# EAGLE design BMW_variante (EAGLE 6.4)

## Sheet 1 of 2
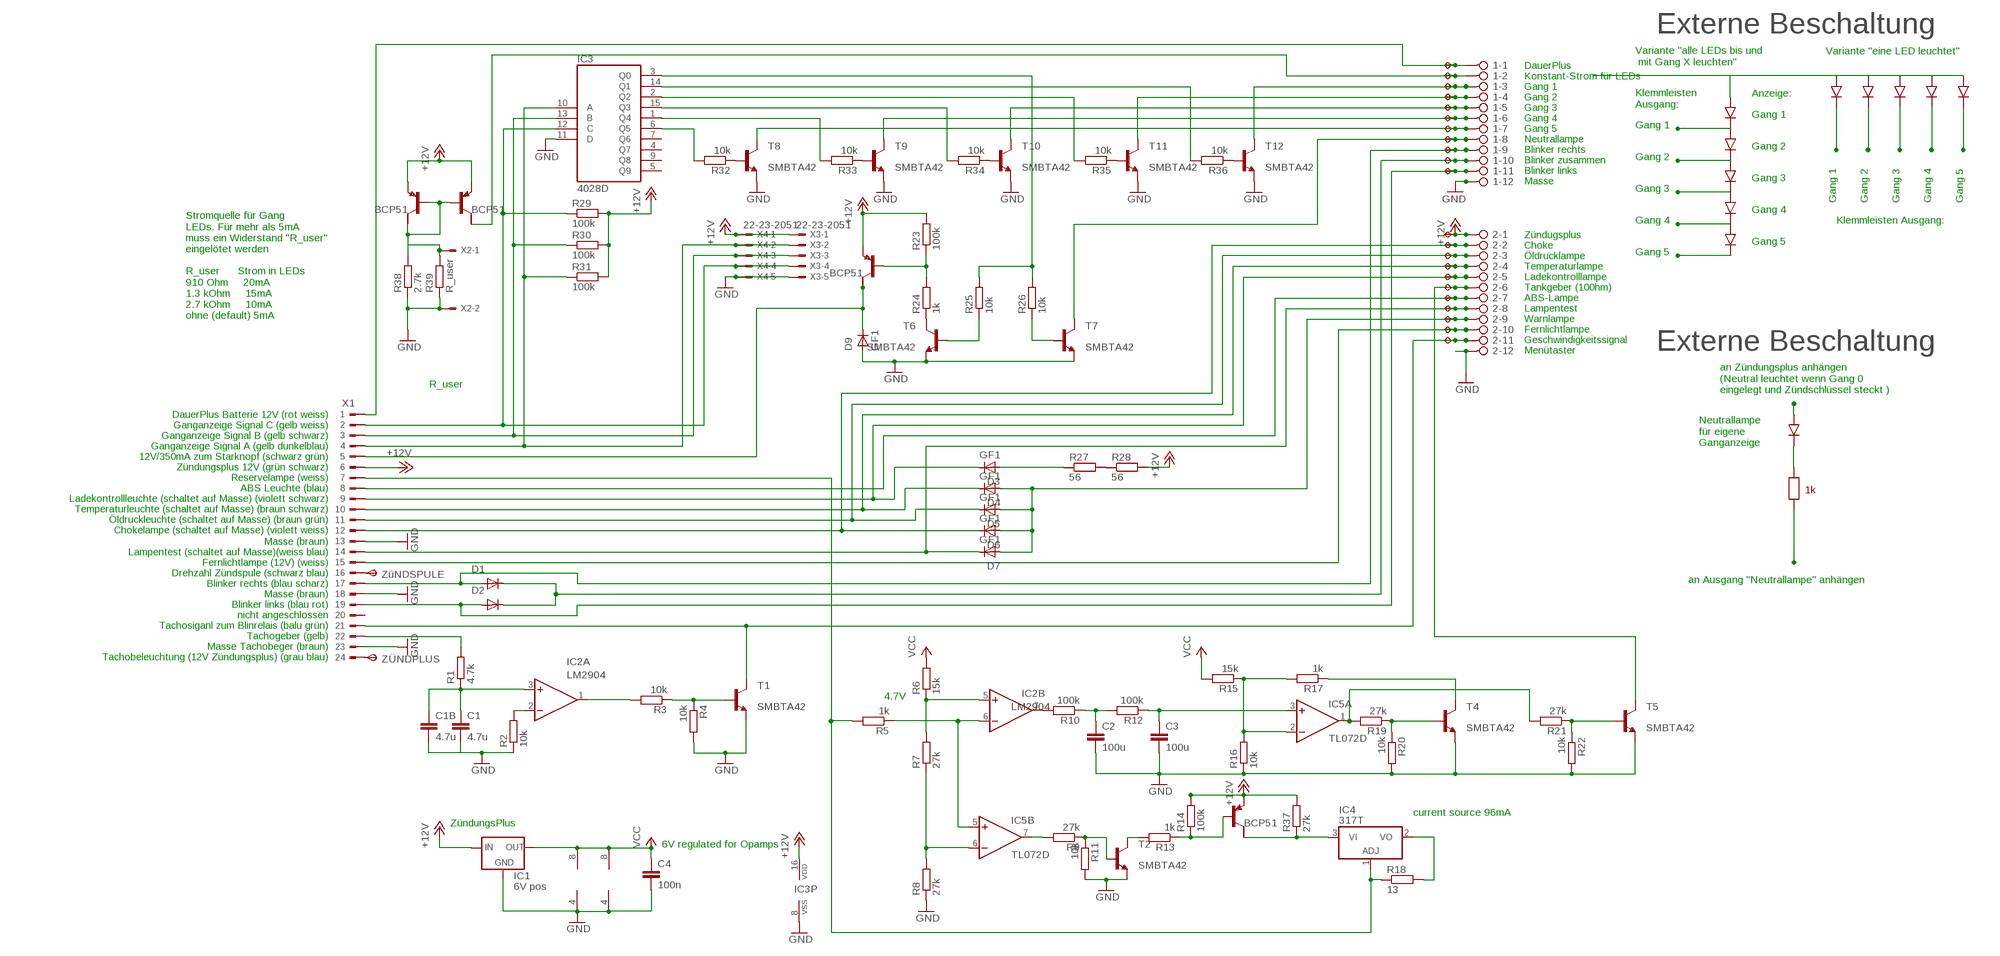
[diagram p0: schematic, sheet 1]

### Parts
1  2081-1132  [12-PIN]
2  2081-1132  [12-PIN]
C1  4.7u  C-EUC1206  [C1206]
C1B  4.7u  C-EUC0805K  [C0805K]
C2  100u  C-EUC1206K  [C1206K]
C3  100u  C-EUC1206K  [C1206K]
C4  100n  C-EUC1206K  [C1206K]
D1  GF1  [SMA-DO214AC]
D2  GF1  [SMA-DO214AC]
D3  GF1  [SMA-DO214AC]
D4  GF1  [SMA-DO214AC]
D5  GF1  [SMA-DO214AC]
D6  GF1  [SMA-DO214AC]
D7  GF1  [SMA-DO214AC]
D9  GF1  [SMA-DO214AC]
IC1  6V pos  78LXX  [78LXX]
IC2  LM358D  [SO08]
IC3  4028D  [SO16]
IC4  317T  [TO220H]
IC5  TL072D  [SO08]
R1  4.7k  R-EU_R0805  [R0805]
R2  10k  R-EU_R0805  [R0805]
R3  10k  R-EU_R0805  [R0805]
R4  10k  R-EU_R0805  [R0805]
R5  1k  R-EU_R0805  [R0805]
R6  15k  R-EU_R0805  [R0805]
R7  27k  R-EU_R0805  [R0805]
R8  27k  R-EU_R0805  [R0805]
R9  27k  R-EU_R0805  [R0805]
R10  100k  R-EU_R0805  [R0805]
R11  10k  R-EU_R0805  [R0805]
R12  100k  R-EU_R0805  [R0805]
R13  1k  R-EU_R0805  [R0805]
R14  100k  R-EU_R0805  [R0805]
R15  15k  R-EU_R0805  [R0805]
R16  10k  R-EU_R0805  [R0805]
R17  1k  R-EU_R0805  [R0805]
R18  13  R-EU_0207/10  [0207/10]
R19  27k  R-EU_R0805  [R0805]
R20  10k  R-EU_R0805  [R0805]
R21  27k  R-EU_R0805  [R0805]
R22  10k  R-EU_R0805  [R0805]
R23  100k  R-EU_R0805  [R0805]
R24  1k  R-EU_R0805  [R0805]
R25  10k  R-EU_R0805  [R0805]
R26  10k  R-EU_R0805  [R0805]
R27  56  R-EU_V235/17  [V235/17]
R28  56  R-EU_V235/17  [V235/17]
R29  100k  R-EU_R0805  [R0805]
R30  100k  R-EU_R0805  [R0805]
R31  100k  R-EU_R0805  [R0805]
R32  10k  R-EU_R0805  [R0805]
R33  10k  R-EU_R0805  [R0805]
R34  10k  R-EU_R0805  [R0805]
R35  10k  R-EU_R0805  [R0805]
R36  10k  R-EU_R0805  [R0805]
R37  27k  R-EU_R0805  [R0805]
R38  2.7k  R-EU_R0805  [R0805]
R39  R_user  R-EU_R0805  [R0805]
T  BCP53T1  [SOT223]
T1  MMBTA42LT1-NPN-SOT23-BEC  [SOT23-BEC]
T2  MMBTA42LT1-NPN-SOT23-BEC  [SOT23-BEC]
T3  BCP53T1  [SOT223]
T4  MMBTA42LT1-NPN-SOT23-BEC  [SOT23-BEC]
T5  MMBTA42LT1-NPN-SOT23-BEC  [SOT23-BEC]
T6  MMBTA42LT1-NPN-SOT23-BEC  [SOT23-BEC]
T7  MMBTA42LT1-NPN-SOT23-BEC  [SOT23-BEC]
T8  MMBTA42LT1-NPN-SOT23-BEC  [SOT23-BEC]
T9  MMBTA42LT1-NPN-SOT23-BEC  [SOT23-BEC]
T10  MMBTA42LT1-NPN-SOT23-BEC  [SOT23-BEC]
T11  MMBTA42LT1-NPN-SOT23-BEC  [SOT23-BEC]
T12  MMBTA42LT1-NPN-SOT23-BEC  [SOT23-BEC]
T13  BCP53T1  [SOT223]
T14  BCP53T1  [SOT223]
TP1  TPB1,27  [B1,27]
TP2  TPB1,27  [B1,27]
TP3  TPB1,27  [B1,27]
TP4  TPB1,27  [B1,27]
TP5  TPB1,27  [B1,27]
TP6  TPB1,27  [B1,27]
TP7  TPB1,27  [B1,27]
TP8  TPB1,27  [B1,27]
TP9  TPB1,27  [B1,27]
TP10  TPB1,27  [B1,27]
TP11  TPB1,27  [B1,27]
TP12  TPB1,27  [B1,27]
TP16  TPB1,27  [B1,27]
TP17  TPB1,27  [B1,27]
TP18  TPB1,27  [B1,27]
TP19  TPB1,27  [B1,27]
TP21  TPB1,27  [B1,27]
TP22  TPB1,27  [B1,27]
TP23  TPB1,27  [B1,27]
TP24  TPB1,27  [B1,27]
TP25  TPB1,27  [B1,27]
TP26  TPB1,27  [B1,27]
X1  CON_BMW  [24-PIN]
X2  22-23-2021  [22-23-2021]
X3  22-23-2051  [22-23-2051]
X4  22-23-2051  [22-23-2051]
ZÜNDPLUS  TPSP1_1MM  [P1_1.0MM]
ZüNDSPULE  TPSP1_1MM  [P1_1.0MM]

### Nets
+12V: 2.1 IC1.IN IC3.16(VDD) R14.2 R23.2 R28.2 R29.2 R30.2 R31.2 R37.2 T3.3(E) T13.3(E) T14.3(E) T.3(E) TP12.TP X1.6 X3.1 X4.1
GND: 1.12 2.12 C1.2 C1B.2 C2.2 C3.2 C4.2 D9.A IC1.GND IC2.4(P:V-) IC3.8(VSS) IC3.11(D) IC5.4(P:V-) R2.1 R4.2 R8.1 R11.2 R16.1 R20.2 R22.2 R38.1 R39.1 T1.E T2.E T4.E T5.E T6.E T7.E T8.E T9.E T10.E T11.E T12.E X1.13 X1.18 X1.23 X2.2 X3.5 X4.5 ; also sheet 2
N$1: 2.9 D4.A D5.A D6.A D7.A TP24.TP
N$2: IC3.10(A) R31.1 X1.4 X3.2 X4.2
N$3: IC3.13(B) R30.1 X1.3 X3.3 X4.3
N$4: 2.7 TP22.TP X1.8
N$5: R25.1 T6.B
N$6: IC3.3(Q0) R25.2 R26.2
N$7: R24.1 T6.C
N$8: R27.2 R28.1
N$9: R23.1 R24.2 T.1(B)
N$10: R26.1 T7.B
N$11: D9.K(C) T.2(C) X1.5
N$12: 2.2 D6.K(C) TP16.TP X1.12
N$13: 2.3 D5.K(C) TP17.TP X1.11
N$14: 2.4 D4.K(C) TP18.TP X1.10
N$15: IC4.1(ADJ) R5.2 R18.1 X1.7
N$16: IC2.6(B:-IN) IC5.5(B:+IN) R5.1
N$17: IC3.12(C) R29.1 X1.2 X3.4 X4.4
N$18: R32.1 T8.B
N$19: 2.8 D7.K(C) TP23.TP X1.14
N$20: 1.9 D1.A TP9.TP X1.17
N$21: 1.11 D2.A TP11.TP X1.19
N$22: 1.10 D1.K(C) D2.K(C) TP10.TP
N$23: R1.2 X1.22
N$24: C1.1 C1B.1 IC2.3(A:+IN) R1.1
N$25: IC2.2(A:-IN) R2.2
N$26: 2.11 T1.C TP26.TP X1.21
N$27: IC2.1(A:OUT) R3.2
N$28: R3.1 R4.1 T1.B
N$29: IC4.2(VO) R18.2
N$30: IC5.6(B:-IN) R7.1 R8.2
N$31: IC5.7(B:OUT) R9.2
N$32: R13.2 T2.C
N$34: R9.1 R11.1 T2.B
N$35: IC4.3(VI) R37.1 T3.2(C)
N$36: R13.1 R14.1 T3.1(B)
N$37: IC3.14(Q1) R36.2
N$38: IC3.2(Q2) R35.2
N$39: 1.5 T10.C TP5.TP
N$40: IC2.5(B:+IN) R6.1 R7.2
N$41: IC2.7(B:OUT) R10.2
N$42: X1.16 ZüNDSPULE.TP(PP)
N$43: IC5.1(A:OUT) R19.2 R21.2
N$44: R19.1 R20.1 T4.B
N$45: C2.1 R10.1 R12.2
N$46: C3.1 IC5.3(A:+IN) R12.1
N$47: IC5.2(A:-IN) R15.1 R16.2 R17.2
N$48: R21.1 R22.1 T5.B
N$49: R17.1 T4.C
N$50: 1.6 T9.C TP6.TP
N$51: R34.1 T10.B
N$52: 1.8 T7.C TP8.TP
N$53: 2.10 TP25.TP X1.15
N$54: D3.A R27.1
N$55: 2.5 D3.K(C) TP19.TP X1.9
N$56: R33.1 T9.B
N$57: R35.1 T11.B
N$58: X1.24 ZÜNDPLUS.TP(PP)
N$59: 1.2 T14.2(C) TP2.TP
N$60: 2.6 T5.C TP21.TP
N$61: IC3.6(Q5) R32.2
N$62: R36.1 T12.B
N$63: 1.7 T8.C TP7.TP
N$64: IC3.1(Q4) R33.2
N$65: IC3.15(Q3) R34.2
N$66: 1.4 T11.C TP4.TP
N$67: 1.3 T12.C TP3.TP
N$68: R38.2 R39.2 T13.1(B) T13.2(C) T14.1(B) X2.1
N$69: 1.1 TP1.TP X1.1
VCC: C4.1 IC1.OUT IC2.8(P:V+) IC5.8(P:V+) R6.2 R15.2 ; also sheet 2
Unconnected: IC3.4(Q7) IC3.5(Q9) IC3.7(Q6) IC3.9(Q8) T3.4(C/) T13.4(C/) T14.4(C/) T.4(C/) X1.20

### Notes on the sheet
- Externe Beschaltung
- Variante "eine LED leuchtet"
- Variante "alle LEDs bis und
   mit Gang X leuchten"
- Anzeige:
- Klemmleisten
  Ausgang:
- Gang 1
- DauerPlus
  Konstant-Strom für LEDs
  Gang 1
  Gang 2
  Gang 3
  Gang 4
  Gang 5
  Neutrallampe
  Blinker rechts
  Blinker zusammen
  Blinker links
  Masse
- Gang 1
- Gang 2
- Gang 2
- Gang 3
- Gang 3
- Gang 1 | Gang 2 | Gang 3 | Gang 4 | Gang 5
- Gang 4
- Gang 4 | Klemmleisten Ausgang:
- Gang 5
- Gang 5
- Zündugsplus
  Choke
  Öldrucklampe
  Temperaturlampe
  Ladekontrolllampe
  Tankgeber (100hm)
  ABS-Lampe
  Lampentest
  Warnlampe
  Fernlichtlampe
  Geschwindigkeitssignal
  Menütaster
- Stromquelle für Gang 
  LEDs. Für mehr als 5mA
  muss ein Widerstand "R_user"
  eingelötet werden 
  
  R_user      Strom in LEDs
  910 Ohm     20mA
  1.3 kOhm     15mA
  2.7 kOhm     10mA
  ohne (default) 5mA
- Externe Beschaltung
- R_user
- an Zündungsplus anhängen
  (Neutral leuchtet wenn Gang 0
  eingelegt und Zündschlüssel steckt )
- Neutrallampe
  für eigene
  Ganganzeige
- DauerPlus Batterie 12V (rot weiss)
  Ganganzeige Signal C (gelb weiss)
  Ganganzeige Signal B (gelb schwarz)
  Ganganzeige Signal A (gelb dunkelblau)
  12V/350mA zum Starknopf (schwarz grün)
  Zündungsplus 12V (grün schwarz)
  Reservelampe (weiss)
  ABS Leuchte (blau)
  Ladekontrollleuchte (schaltet auf Masse) (violett schwarz)
  Temperaturleuchte (schaltet auf Masse) (braun schwarz)
  Öldruckleuchte (schaltet auf Masse) (braun grün)
  Chokelampe (schaltet auf Masse) (violett weiss)
- 1k
- an Ausgang "Neutrallampe" anhängen
- Masse (braun)
  Lampentest (schaltet auf Masse)(weiss blau)
  Fernlichtlampe (12V) (weiss)
  Drehzahl Zündspule (schwarz blau)
  Blinker rechts (blau scharz)
  Masse (braun)
  Blinker links (blau rot)
  nicht angeschlossen
  Tachosiganl zum Blinrelais (balu grün)
  Tachogeber (gelb)
  Masse Tachobeger (braun)
  Tachobeleuchtung (12V Zündungsplus) (grau blau)
- 4.7V
- current source 96mA
- ZündungsPlus
- 6V regulated for Opamps

## Sheet 2 of 2
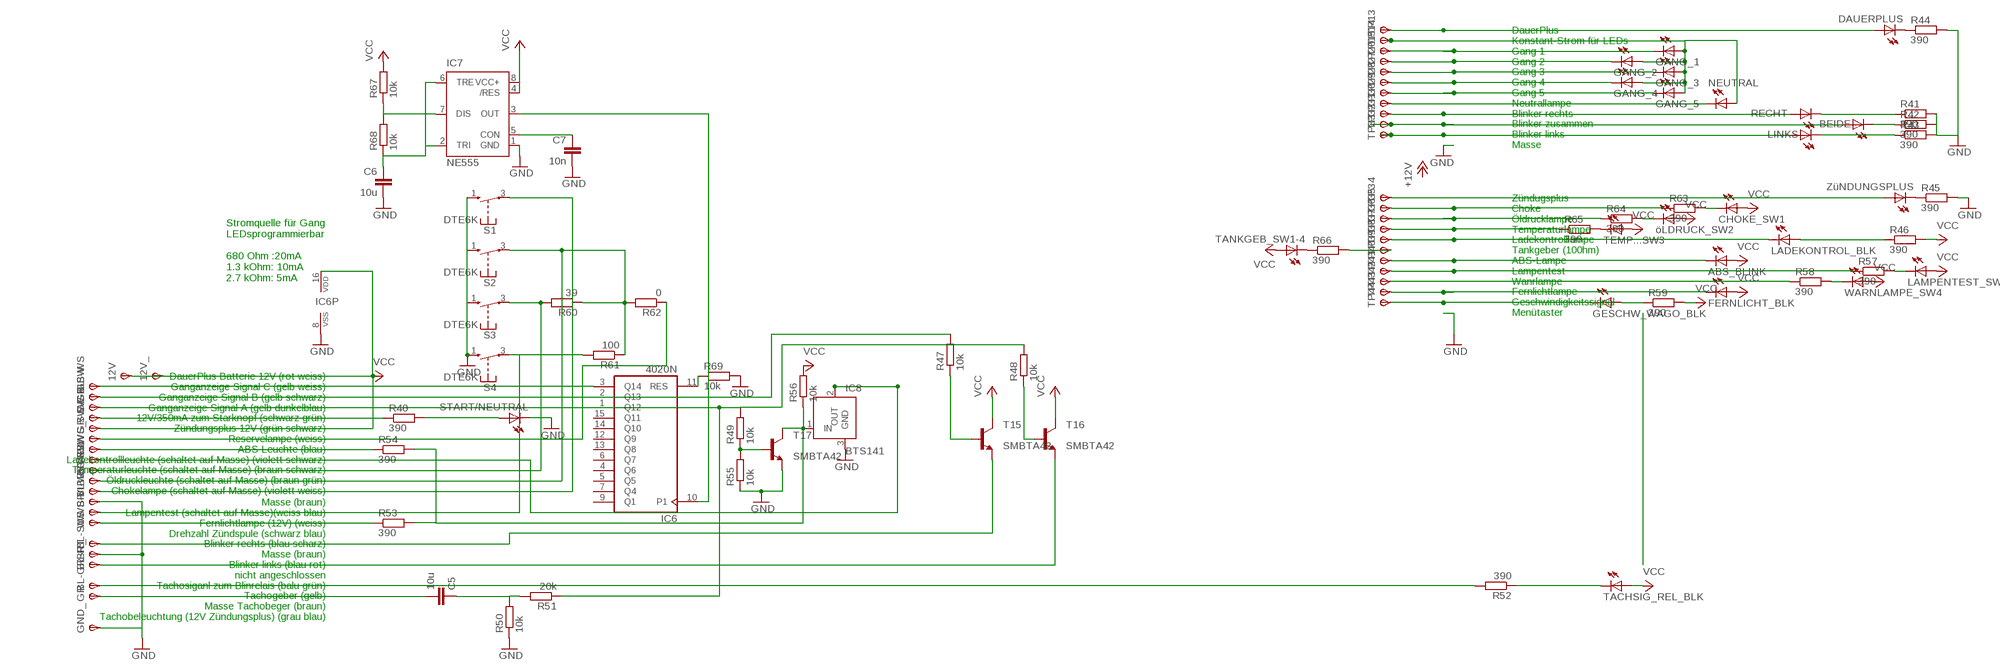
[diagram p1: schematic, sheet 2]

### Parts
12V  TPSPAD1-1.5MM  [P1-13]
12V_  TPSPAD1-1.5MM  [P1-13]
ABS_BLINK  TLLY4400  [LED3MM]
BEIDE  TLLY4400  [LED3MM]
BL  TPSPAD1-1.5MM  [P1-13]
BL-GR  TPSPAD1-1.5MM  [P1-13]
BL-RT  TPSPAD1-1.5MM  [P1-13]
BL-SW  TPSPAD1-1.5MM  [P1-13]
BR  TPSPAD1-1.5MM  [P1-13]
BR-GR  TPSPAD1-1.5MM  [P1-13]
BR-SW  TPSPAD1-1.5MM  [P1-13]
BR_  TPSPAD1-1.5MM  [P1-13]
C5  10u  C-EU025-024X044  [C025-024X044]
C6  10u  C-EU025-024X044  [C025-024X044]
C7  10n  C-EU025-024X044  [C025-024X044]
CHOKE_SW1  TLLY4400  [LED3MM]
DAUERPLUS  TLLY4400  [LED3MM]
FERNLICHT_BLK  TLLY4400  [LED3MM]
GANG_1  TLLY4400  [LED3MM]
GANG_2  TLLY4400  [LED3MM]
GANG_3  TLLY4400  [LED3MM]
GANG_4  TLLY4400  [LED3MM]
GANG_5  TLLY4400  [LED3MM]
GB-SW  TPSPAD1-1.5MM  [P1-13]
GB-WS  TPSPAD1-1.5MM  [P1-13]
GE-BL  TPSPAD1-1.5MM  [P1-13]
GESCHW_WAGO_BLK  TLLY4400  [LED3MM]
GND_  TPSPAD1-1.5MM  [P1-13]
GR  TPSPAD1-1.5MM  [P1-13]
GR-SW  TPSPAD1-1.5MM  [P1-13]
IC6  4020N  [DIL16]
IC7  NE555  [DIL-08]
IC8  BTS141  [TO220-3-45]
LADEKONTROL_BLK  TLLY4400  [LED3MM]
LAMPENTEST_SW4  TLLY4400  [LED3MM]
LINKS  TLLY4400  [LED3MM]
NEUTRAL  TLLY4400  [LED3MM]
R40  390  R-EU_R0805  [R0805]
R41  390  R-EU_R0805  [R0805]
R42  390  R-EU_R0805  [R0805]
R43  390  R-EU_R0805  [R0805]
R44  390  R-EU_R0805  [R0805]
R45  390  R-EU_R0805  [R0805]
R46  390  R-EU_R0805  [R0805]
R47  10k  R-EU_R0805  [R0805]
R48  10k  R-EU_R0805  [R0805]
R49  10k  R-EU_R0805  [R0805]
R50  10k  R-EU_0207/12  [0207/12]
R51  20k  R-EU_0207/12  [0207/12]
R52  390  R-EU_R0805  [R0805]
R53  390  R-EU_R0805  [R0805]
R54  390  R-EU_R0805  [R0805]
R55  10k  R-EU_R0805  [R0805]
R56  10k  R-EU_R0805  [R0805]
R57  390  R-EU_R0805  [R0805]
R58  390  R-EU_R0805  [R0805]
R59  390  R-EU_R0805  [R0805]
R60  39  R-EU_0207/12  [0207/12]
R61  100  R-EU_0207/12  [0207/12]
R62  0  R-EU_0207/12  [0207/12]
R63  390  R-EU_R0805  [R0805]
R64  390  R-EU_R0805  [R0805]
R65  390  R-EU_R0805  [R0805]
R66  390  R-EU_R0805  [R0805]
R67  10k  R-EU_0207/12  [0207/12]
R68  10k  R-EU_0207/15  [0207/15]
R69  10k  R-EU_R0805  [R0805]
RECHT  TLLY4400  [LED3MM]
S1  DTE6K  [DTE6K]
S2  DTE6K  [DTE6K]
S3  DTE6K  [DTE6K]
S4  DTE6K  [DTE6K]
START/NEUTRAL  TLLY4400  [LED3MM]
SW-GR  TPSPAD1-1.5MM  [P1-13]
T15  MMBTA42LT1-NPN-SOT23-BEC  [SOT23-BEC]
T16  MMBTA42LT1-NPN-SOT23-BEC  [SOT23-BEC]
T17  MMBTA42LT1-NPN-SOT23-BEC  [SOT23-BEC]
TACHSIG_REL_BLK  TLLY4400  [LED3MM]
TANKGEB_SW1-4  TLLY4400  [LED3MM]
TEMP...SW3  TLLY4400  [LED3MM]
TP13  TPSPAD1-1.5MM  [P1-13]
TP14  TPSPAD1-1.5MM  [P1-13]
TP15  TPSPAD1-1.5MM  [P1-13]
TP20  TPSPAD1-1.5MM  [P1-13]
TP27  TPSPAD1-1.5MM  [P1-13]
TP28  TPSPAD1-1.5MM  [P1-13]
TP29  TPSPAD1-1.5MM  [P1-13]
TP30  TPSPAD1-1.5MM  [P1-13]
TP31  TPSPAD1-1.5MM  [P1-13]
TP32  TPSPAD1-1.5MM  [P1-13]
TP33  TPSPAD1-1.5MM  [P1-13]
TP34  TPSPAD1-1.5MM  [P1-13]
TP35  TPSPAD1-1.5MM  [P1-13]
TP36  TPSPAD1-1.5MM  [P1-13]
TP37  TPSPAD1-1.5MM  [P1-13]
TP38  TPSPAD1-1.5MM  [P1-13]
TP39  TPSPAD1-1.5MM  [P1-13]
TP40  TPSPAD1-1.5MM  [P1-13]
TP41  TPSPAD1-1.5MM  [P1-13]
TP42  TPSPAD1-1.5MM  [P1-13]
TP43  TPSPAD1-1.5MM  [P1-13]
TP44  TPSPAD1-1.5MM  [P1-13]
VI-SW  TPSPAD1-1.5MM  [P1-13]
VI-WS  TPSPAD1-1.5MM  [P1-13]
WARNLAMPE_SW4  TLLY4400  [LED3MM]
WS  TPSPAD1-1.5MM  [P1-13]
WS-BL  TPSPAD1-1.5MM  [P1-13]
WS_  TPSPAD1-1.5MM  [P1-13]
ZüNDUNGSPLUS  TLLY4400  [LED3MM]
öLDRUCK_SW2  TLLY4400  [LED3MM]

### Nets
GND: BR.TP(PP) BR_.TP(PP) C6.2 C7.2 GND_.TP(PP) IC6.8(VSS) IC7.1(GND) IC8.3(GND) R41.2 R42.2 R43.2 R44.2 R45.2 R50.1 R55.1 R69.2 S1.1(S) S2.1(S) S3.1(S) S4.1(S) START/NEUTRAL.K(C) T17.E ; also sheet 1
N$75: R58.1 TP42.TP(PP)
N$83: ABS_BLINK.K(C) TP40.TP(PP)
N$84: R64.1 TP36.TP(PP)
N$85: R65.1 TP37.TP(PP)
N$86: R57.1 TP41.TP(PP)
N$87: RECHT.A TP31.TP(PP)
N$88: LINKS.A TP33.TP(PP)
N$89: BEIDE.A TP32.TP(PP)
N$90: GESCHW_WAGO_BLK.K(C) TP44.TP(PP)
N$91: NEUTRAL.K(C) TP30.TP(PP)
N$92: GANG_5.K(C) TP29.TP(PP)
N$93: GANG_1.A GANG_2.A GANG_3.A GANG_4.A GANG_5.A NEUTRAL.A TP14.TP(PP)
N$94: DAUERPLUS.A TP13.TP(PP)
N$95: GANG_3.K(C) TP27.TP(PP)
N$96: GANG_4.K(C) TP28.TP(PP)
N$97: R66.2 TP39.TP(PP)
N$98: GANG_2.K(C) TP20.TP(PP)
N$99: GANG_1.K(C) TP15.TP(PP)
N$100: GB-WS.TP(PP) IC6.3(Q14)
N$101: GB-SW.TP(PP) IC6.2(Q13) R47.2
N$102: LADEKONTROL_BLK.K(C) TP38.TP(PP)
N$103: R40.2 START/NEUTRAL.A
N$104: R40.1 SW-GR.TP(PP)
N$105: IC8.1(IN) R53.2 R54.2 R56.1 T17.C
N$106: R41.1 RECHT.K(C)
N$107: BEIDE.K(C) R42.1
N$108: LINKS.K(C) R43.1
N$109: DAUERPLUS.K(C) R44.1
N$110: R45.1 ZüNDUNGSPLUS.K(C)
N$111: FERNLICHT_BLK.K(C) TP43.TP(PP)
N$112: R47.1 T15.B
N$113: R48.1 T16.B
N$114: BL-SW.TP(PP) T15.E
N$115: BL-RT.TP(PP) T16.E
N$116: R49.1 R55.2 T17.B
N$117: C5.1 R50.2 R51.2
N$118: C5.2 GR.TP(PP)
N$119: R52.1 TACHSIG_REL_BLK.K(C)
N$120: BL-GR.TP(PP) R52.2
N$121: GE-BL.TP(PP) IC6.1(Q12) R48.2 R49.2 R51.1
N$122: R53.1 WS.TP(PP)
N$123: BL.TP(PP) R54.1
N$124: LADEKONTROL_BLK.A R46.1
N$125: IC8.2(OUT) VI-SW.TP(PP)
N$126: R58.2 WARNLAMPE_SW4.K(C)
N$127: LAMPENTEST_SW4.K(C) R57.2
N$128: GESCHW_WAGO_BLK.A R59.1
N$129: BR-GR.TP(PP) R60.1 R61.1 R62.2 S2.3(P)
N$130: R61.2 S4.3(P) WS-BL.TP(PP)
N$131: BR-SW.TP(PP) R60.2 S3.3(P)
N$132: R63.1 TP35.TP(PP)
N$133: R64.2 öLDRUCK_SW2.K(C)
N$134: CHOKE_SW1.K(C) R63.2
N$135: R65.2 TEMP...SW3.K(C)
N$137: R66.1 TANKGEB_SW1-4.K(C)
N$138: C6.1 IC7.2(TRI) IC7.6(TRE) R68.1
N$139: IC7.7(DIS) R67.1 R68.2
N$140: C7.1 IC7.5(CON)
N$141: IC6.10(P1) IC7.3(OUT)
N$142: TP34.TP(PP) ZüNDUNGSPLUS.A
N$143: IC6.11(RES) R69.1
VCC: 12V.TP(PP) 12V_.TP(PP) ABS_BLINK.A CHOKE_SW1.A FERNLICHT_BLK.A GR-SW.TP(PP) IC6.16(VDD) IC7.4(/RES) IC7.8(VCC+) LAMPENTEST_SW4.A R46.2 R56.2 R59.2 R67.2 T15.C T16.C TACHSIG_REL_BLK.A TANKGEB_SW1-4.A TEMP...SW3.A WARNLAMPE_SW4.A öLDRUCK_SW2.A ; also sheet 1
VI-WS: S1.3(P) VI-WS.TP(PP)
WS: R62.1 WS_.TP(PP)
Unconnected: IC6.4(Q6) IC6.5(Q5) IC6.6(Q7) IC6.7(Q4) IC6.9(Q1) IC6.12(Q9) IC6.13(Q8) IC6.14(Q10) IC6.15(Q11)

### Notes on the sheet
- DauerPlus
  Konstant-Strom für LEDs
  Gang 1
  Gang 2
  Gang 3
  Gang 4
  Gang 5
  Neutrallampe
  Blinker rechts
  Blinker zusammen
  Blinker links
  Masse
- Zündugsplus
  Choke
  Öldrucklampe
  Temperaturlampe
  Ladekontrolllampe
  Tankgeber (100hm)
  ABS-Lampe
  Lampentest
  Wanrlampe
  Fernlichtlampe
  Geschwindigkeitssignal
  Menütaster
- Stromquelle für Gang 
  LEDsprogrammierbar
  
  680 Ohm :20mA
  1.3 kOhm: 10mA
  2.7 kOhm: 5mA
- DauerPlus Batterie 12V (rot weiss)
  Ganganzeige Signal C (gelb weiss)
  Ganganzeige Signal B (gelb schwarz)
  Ganganzeige Signal A (gelb dunkelblau)
  12V/350mA zum Starknopf (schwarz grün)
  Zündungsplus 12V (grün schwarz)
  Reservelampe (weiss)
  ABS Leuchte (blau)
  Ladekontrollleuchte (schaltet auf Masse) (violett schwarz)
  Temperaturleuchte (schaltet auf Masse) (braun schwarz)
  Öldruckleuchte (schaltet auf Masse) (braun grün)
  Chokelampe (schaltet auf Masse) (violett weiss)
- Masse (braun)
  Lampentest (schaltet auf Masse)(weiss blau)
  Fernlichtlampe (12V) (weiss)
  Drehzahl Zündspule (schwarz blau)
  Blinker rechts (blau scharz)
  Masse (braun)
  Blinker links (blau rot)
  nicht angeschlossen
  Tachosiganl zum Blinrelais (balu grün)
  Tachogeber (gelb)
  Masse Tachobeger (braun)
  Tachobeleuchtung (12V Zündungsplus) (grau blau)

## Library data of the parts
1 2 = con WAGO BMW:2081-1132: WAGO SREW CLAMP
12V 12V_ BL BL-GR BL-RT BL-SW BR BR-GR BR-SW BR_ GB-SW GB-WS GE-BL GND_ GR GR-SW SW-GR TP13-TP15 TP20 TP27-TP44 VI-SW VI-WS WS WS-BL WS_ ZÜNDPLUS ZüNDSPULE = testpin_BMW:TPS: TEST PIN
ABS_BLINK BEIDE CHOKE_SW1 DAUERPLUS FERNLICHT_BLK GANG_1-GANG_5 GESCHW_WAGO_BLK LADEKONTROL_BLK LAMPENTEST_SW4 LINKS NEUTRAL RECHT START/NEUTRAL TACHSIG_REL_BLK TANKGEB_SW1-4 TEMP...SW3 WARNLAMPE_SW4 ZüNDUNGSPLUS öLDRUCK_SW2 = led:TLLY4400: Low Current (2mA) LED 3 mm Tinted Diffused Package color YELLOW Source: Data sheet <http://www.farnell.com/datasheets/391098.pdf>; MF: VISHAY SEMICONDUCTOR; OC_FARNELL: 1612439
C1 C1B C2-C7 = rcl:C-EU: CAPACITOR, European symbol
D1-D7 D9 = diode:GF1: DIODE
IC1 = v-reg:78LXX: VOLTAGE REGULATOR
IC2 = linear:LM358: OP AMP also LM158; LM258; LM2904 Source: http://cache.national.com/ds/LM/LM158.pdf; IC: LM2904
IC3 = 40xx:4028: BCD to decimal DECODER
IC4 = linear:*317: Positive VOLTAGE REGULATOR
IC5 = linear:TL072: OP AMP
IC6 = 40xx:4020: 14-stage binary/ripple COUNTER
IC7 = st-microelectronics:NE555: General purpose bipolar Timer; MF: Arrow Electronics; MPN: NE555N; OC_FARNELL: 1467742; OC_NEWARK: 89K1486
IC8 = optosonde_bruker:BTS141: Smart High-Side Power Switch One Channel: 60mOhm Status Feedback Source: Source: www.infineon.com .. BTS428L2_20030912.pdf
R1-R69 = rcl:R-EU_: RESISTOR, European symbol
S1-S4 = switch:DT: ITT SWITCH
T T3 T13 T14 = BCP53_:BCP53*; T: BCP51
T1 T2 T4-T12 T15-T17 = transistor:*-NPN-: NPN Transistror BF959 corrected 2008.03.06; T: SMBTA42
TP1-TP12 TP16-TP19 TP21-TP26 = testpad:TP: Test pad
X1 = con_BMW:CON_BMW: BMW CONNECTOR
X2 = con-molex:22-23-2021: .100" (2.54mm) Center Header - 2 Pin; MF: MOLEX; MPN: 22-23-2021; OC_FARNELL: 1462926; OC_NEWARK: 25C3832
X3 X4 = con-molex:22-23-2051: .100" (2.54mm) Center Header - 5 Pin; MF: MOLEX; MPN: 22-23-2051; OC_FARNELL: 1462952; OC_NEWARK: 38C9178

## Board
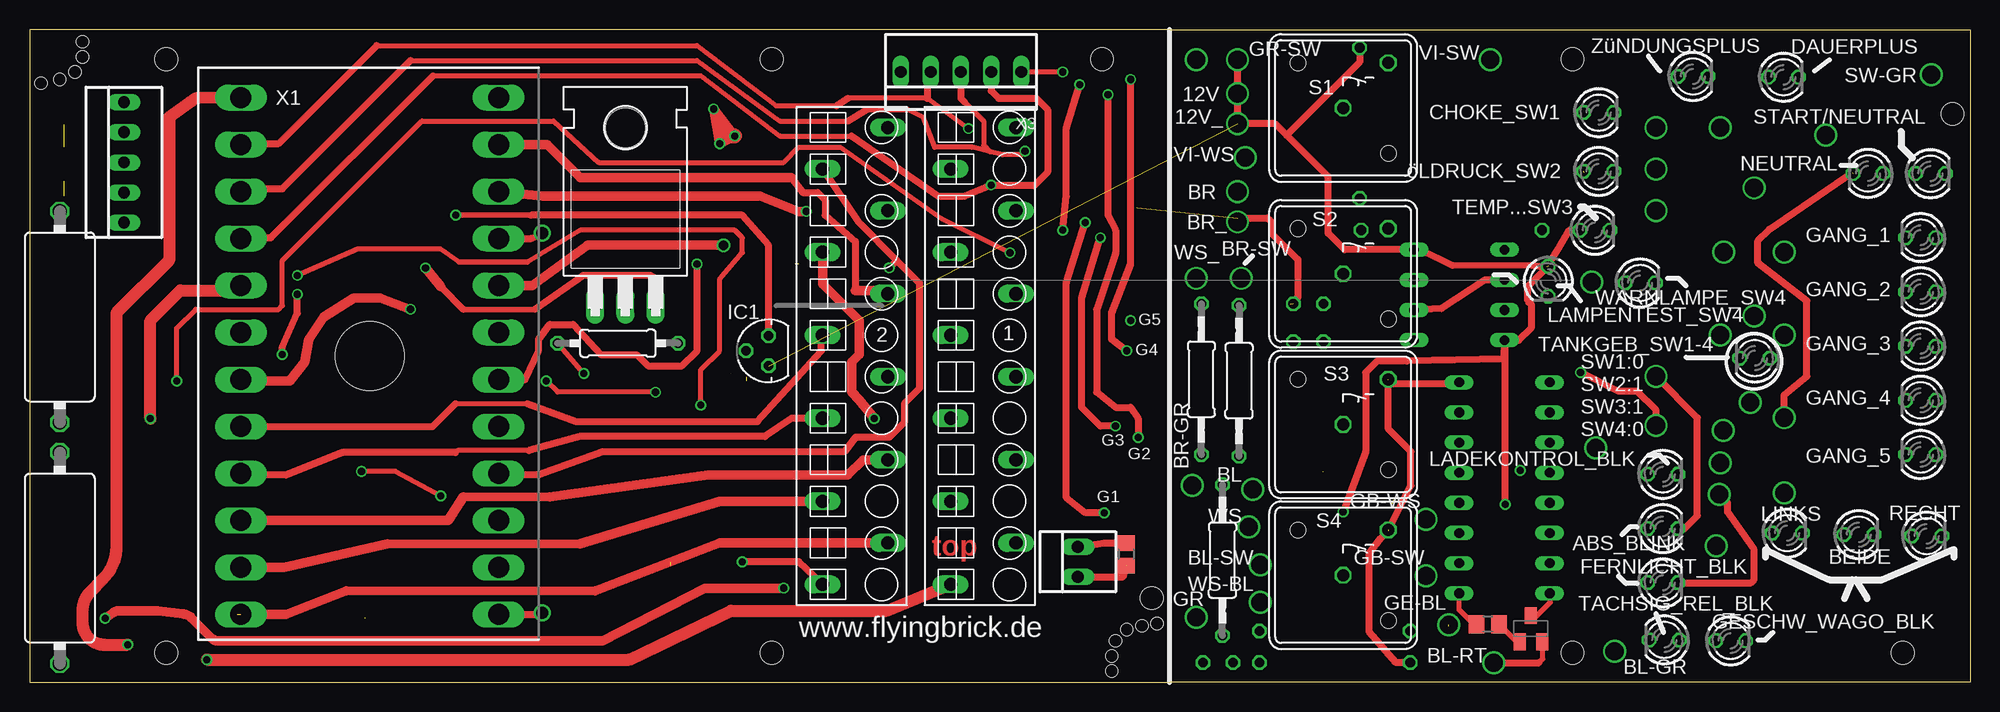
[diagram p2: board, top side]
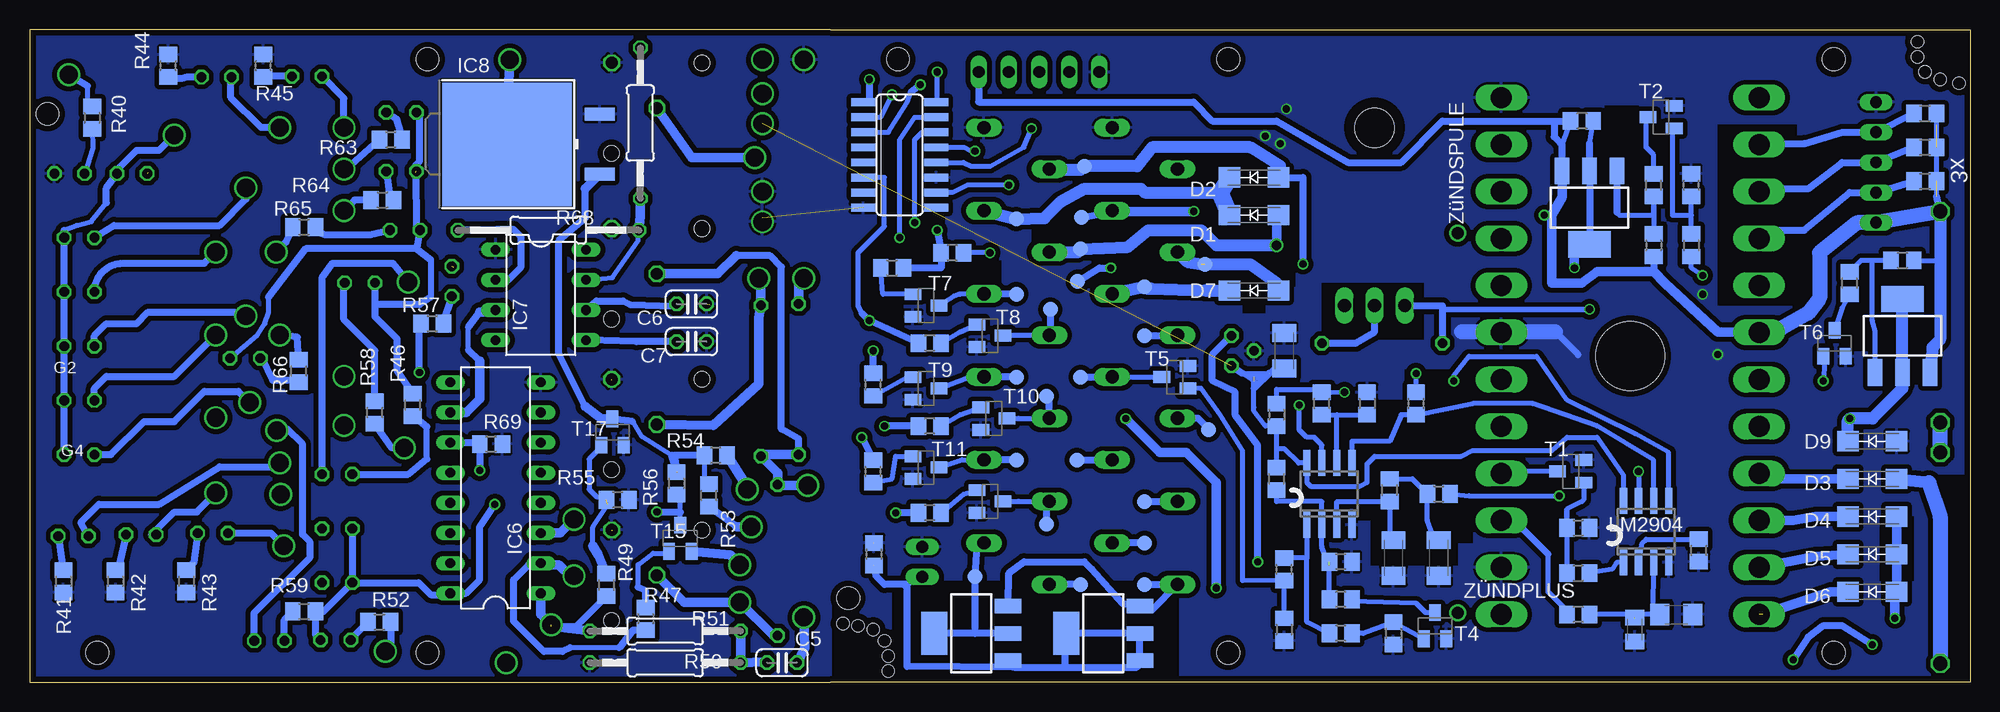
[diagram p3: board, bottom side, seen from below]

Size 163.43 x 55 mm. Coordinates in mm from the lower left corner, seen from the top.
Outline: 0,0 96,0 163.43,0 163.43,55 96,55 0,55 0,0
Copper layers (1*16): Top 0.035mm / dielectric 1.5mm / Bottom 0.035mm
Design rules "multi-cb_035um-cu *": minimum track width 6mil, minimum drill 12mil, track to track 16mil, track to pad 20mil, pad to pad 16mil, via to via 16mil, smd to smd 16mil, copper to edge 20mil, drill to drill 8mil, minimum pad ring 8mil, minimum via ring 6mil, stop-mask expansion 3mil, vias tented up to drill 0mil, thermal gap 8mil
Holes 5.8 mm at 28.64,27.5
Holes 1.91 mm at 11.5,52.5 62.5,52.5 11.5,2.5 62.5,2.5 90.3,52.5 94.5,7.1 129.93,2.5 129.93,52.5 157.72,2.5 161.93,47.9
Holes 1.02 mm at 0.95,50.48 2.54,50.8 3.81,51.44 4.45,52.7 4.45,53.98 94.93,4.95 93.66,4.76 92.39,4.45 91.44,3.49 91.12,2.22 91.12,0.95
bRestrict: area 27.9,35.9 to 30.8,48.6; area 14.6,31.8 to 21.3,47; area 47.9,21 to 52.7,23.8; area 43.2,9.8 to 50.5,14; area 41.9,11.7 to 43.8,14; area 49.8,13.7 to 51.8,14.9; area 42.2,23.8 to 47.6,26.4; area 59.4,31.1 to 61.3,33.3; area 46,28.9 to 54.6,33.7; area 66.7,0.6 to 90.8,8.6; area 2.9,25.1 to 8.3,31.1; area 56.8,33.3 to 58.7,37.1; 9 more areas

### Footprints (pad centres in the part's own frame; a part is rotated, then mirrored left to right if it is on the bottom)
12-PIN = drill 1.118 long: 1 19.25,-2.45; 2 15.75,3.05; 3 12.25,-2.45; 4 8.75,3.05; 5 5.25,-2.45; 6 1.75,3.05; 7 -1.75,-2.45; 8 -5.25,3.05; 9 -8.75,-2.45; 10 -12.25,3.05; 11 -15.75,-2.45; 12 -19.25,3.05
P1-13 = drill 1.524: TP 0,0
LED3MM = drill 0.813 octagon: A -1.27,0; K 1.27,0
C1206 = smd 1.6 x 1.8: 1 -1.4,0; 2 1.4,0
C0805K = smd 1.3 x 1.6: 1 -1,0; 2 1,0
C1206K = smd 1.5 x 2: 1 -1.5,0; 2 1.5,0
C025-024X044 = drill 0.813 octagon: 1 -1.27,0; 2 1.27,0
SMA-DO214AC = smd 1.8 x 1.7: A -2.05,0; K 2.05,0
78LXX = drill 0.813 octagon: GND 0,1.905; IN 1.27,0; OUT -1.27,0
SO08 = smd 0.6 x 2.2: 1 -1.905,-2.6; 2 -0.635,-2.6; 3 0.635,-2.6; 4 1.905,-2.6; 5 1.905,2.6; 6 0.635,2.6; 7 -0.635,2.6; 8 -1.905,2.6
SO16 = smd 0.66 x 2.032: 1 -4.445,-3.073; 2 -3.175,-3.073; 3 -1.905,-3.073; 4 -0.635,-3.073; 5 0.635,-3.073; 6 1.905,-3.073; 7 3.175,-3.073; 8 4.445,-3.073; 9 4.445,3.073; 10 3.175,3.073; 11 1.905,3.073; 12 0.635,3.073; 13 -0.635,3.073; 14 -1.905,3.073; 15 -3.175,3.073; 16 -4.445,3.073
TO220H = drill 1.118 long: 1 -2.54,-10.16; 2 0,-10.16; 3 2.54,-10.16 | hole 3.302: 0,4.826
DIL16 = drill 0.813 long: 1 -8.89,-3.81; 2 -6.35,-3.81; 3 -3.81,-3.81; 4 -1.27,-3.81; 5 1.27,-3.81; 6 3.81,-3.81; 7 6.35,-3.81; 8 8.89,-3.81; 9 8.89,3.81; 10 6.35,3.81; 11 3.81,3.81; 12 1.27,3.81; 13 -1.27,3.81; 14 -3.81,3.81; 15 -6.35,3.81; 16 -8.89,3.81
DIL-08 = drill 0.813 long: 1 -3.81,-3.81; 2 -1.27,-3.81; 3 1.27,-3.81; 4 3.81,-3.81; 5 3.81,3.81; 6 1.27,3.81; 7 -1.27,3.81; 8 -3.81,3.81
TO220-3-45 = smd 1.1 x 2.5: 1 -2.54,-2.55; 3 2.54,-2.55 | smd 10.4 x 10.9: 2 0,5.25
R0805 = smd 1.3 x 1.5: 1 -0.95,0; 2 0.95,0
0207/10 = drill 0.813 octagon: 1 -5.08,0; 2 5.08,0
V235/17 = drill 1.194 octagon: 1 -8.89,0; 2 8.89,0
0207/12 = drill 0.813 octagon: 1 -6.35,0; 2 6.35,0
0207/15 = drill 0.813 octagon: 1 -7.62,0; 2 7.62,0
DTE6K = drill 1 octagon: 1 -3.81,3.81; 3 0,0 | hole 1.3: 3.81,3.81; -3.81,-3.81
SOT223 = smd 1.219 x 2.235: 1 -2.311,-3.099; 2 0,-3.099; 3 2.311,-3.099 | smd 3.6 x 2.2: 4 0,3.099
SOT23-BEC = smd 1 x 1.4: B -0.95,-1.1; C 0,1.1; E 0.95,-1.1
B1,27 = smd 1.27 x 1.27: TP 0,0
24-PIN = drill 1.778 long: 1 -21.78,-10.85; 2 -17.82,-10.85; 3 -13.86,-10.85; 4 -9.9,-10.85; 5 -5.94,-10.85; 6 -1.98,-10.85; 7 1.98,-10.85; 8 5.94,-10.85; 9 9.9,-10.85; 10 13.86,-10.85; 11 17.82,-10.85; 12 21.78,-10.85; 13 -21.78,10.85; 14 -17.82,10.85; 15 -13.86,10.85; 16 -9.9,10.85; 17 -5.94,10.85; 18 -1.98,10.85; 19 1.98,10.85; 20 5.94,10.85; 21 9.9,10.85; 22 13.86,10.85; 23 17.82,10.85; 24 21.78,10.85
22-23-2021 = drill 1 long: 1 -1.27,0; 2 1.27,0
22-23-2051 = drill 1 long: 1 -5.08,0; 2 -2.54,0; 3 0,0; 4 2.54,0; 5 5.08,0
P1_1.0MM = drill 1.016: TP 0,0

### Placement (x,y rotation side)
1  80.01,27.5 270 top
2  69.22,27.5 270 top
12V  101.72,49.6 180 top
12V_  101.72,47.06 180 top
ABS_BLINK  137.53,12.96 0 top
BEIDE  154.04,12.46 0 top
BL  102.98,16.27 90 top
BL-GR  133.47,2.61 180 top
BL-RT  123.31,1.66 180 top
BL-SW  103.62,9.91 0 top
BR  101.72,41.35 180 top
BR-GR  97.91,16.58 180 top
BR-SW  102.03,34.05 90 top
BR_  101.72,38.81 180 top
C1  24.77,5.71 0 bottom
C1B  28.26,4.45 270 bottom
C2  44.77,10.48 270 bottom
C3  48.58,10.48 270 bottom
C4  57.78,27.94 90 bottom
C5  100.06,1.66 0 bottom
C6  107.68,31.89 0 bottom
C7  107.68,28.71 0 bottom
CHOKE_SW1  132.13,48.02 0 top
D1  60.33,39.37 180 bottom
D2  60.33,42.55 180 bottom
D3  8.26,17.14 180 bottom
D4  8.26,13.97 180 bottom
D5  8.26,10.79 180 bottom
D6  8.26,7.62 180 bottom
D7  60.33,33.02 180 bottom
D9  8.26,20.32 180 bottom
DAUERPLUS  147.69,51 0 top
FERNLICHT_BLK  137.53,8.39 0 top
GANG_1  159.25,37.47 180 top
GANG_2  159.25,32.9 180 top
GANG_3  159.25,28.33 180 top
GANG_4  159.25,23.76 180 top
GANG_5  159.25,19.19 180 top
GB-SW  117.59,8.96 0 top
GB-WS  117.59,13.72 0 top
GE-BL  119.5,4.83 0 top
GESCHW_WAGO_BLK  143.24,3.5 0 top
GND_  98.22,52.46 0 top
GR  98.22,5.47 0 top
GR-SW  101.72,52.46 180 top
IC1  62.23,27.94 90 top
IC2  27.3,12.7 0 bottom
IC3  90.17,44.45 270 bottom
IC4  50.16,41.91 0 top
IC5  53.98,15.88 0 bottom
IC6  124.19,16.39 90 bottom
IC7  120.38,32.65 270 bottom
IC8  117.97,45.35 90 bottom
LADEKONTROL_BLK  137.53,17.54 0 top
LAMPENTEST_SW4  127.88,33.79 270 top
LINKS  148.01,12.58 0 top
NEUTRAL  154.8,42.87 180 top
R1  33.02,5.71 180 bottom
R2  22.86,11.11 90 bottom
R3  33.02,9.21 0 bottom
R4  33.02,13.02 0 bottom
R5  46.67,23.5 90 bottom
R6  58.42,22.54 270 bottom
R7  54.61,23.5 90 bottom
R8  50.8,23.5 270 bottom
R9  23.5,36.83 270 bottom
R10  44.77,15.88 0 bottom
R11  23.5,41.91 90 bottom
R12  48.9,16.19 90 bottom
R13  26.67,41.91 90 bottom
R14  26.67,36.83 270 bottom
R15  58.42,17.14 90 bottom
R16  53.02,10.16 180 bottom
R17  53.02,6.99 180 bottom
R18  49.53,28.57 0 top
R19  53.02,4.13 180 bottom
R20  48.58,4.13 270 bottom
R21  57.78,9.53 90 bottom
R22  57.78,4.45 270 bottom
R23  5.71,35.56 0 bottom
R24  10.16,33.66 90 bottom
R25  85.72,36.2 180 bottom
R26  90.81,34.92 0 bottom
R27  2.54,10.48 90 top
R28  2.54,30.8 90 top
R29  3.81,47.94 0 bottom
R30  3.81,45.09 0 bottom
R31  3.81,42.23 0 bottom
R32  87.63,28.57 180 bottom
R33  92.39,25.08 90 bottom
R34  87.63,21.59 180 bottom
R35  92.39,17.78 90 bottom
R36  87.63,14.29 180 bottom
R37  32.7,47.31 180 bottom
R38  92.33,10.79 270 bottom
R39  92.33,10.79 270 top
R40  158.17,47.57 270 bottom
R41  160.58,8.52 270 bottom
R42  156.2,8.52 270 bottom
R43  150.23,8.52 270 bottom
R44  151.75,51.95 90 bottom
R45  143.75,51.95 90 bottom
R46  131.18,23.38 90 bottom
R47  111.56,5.34 270 bottom
R48  122.8,4.9 180 top
R49  114.86,8.2 270 bottom
R50  109.91,1.66 0 bottom
R51  109.91,4.33 0 bottom
R52  133.97,5.09 0 bottom
R53  106.22,15.76 90 bottom
R54  105.65,19.12 180 bottom
R55  113.91,15.38 180 bottom
R56  108.95,16.77 270 bottom
R57  129.53,30.23 0 bottom
R58  134.35,22.74 90 bottom
R59  140.32,5.98 0 bottom
R60  101.84,25.41 90 top
R61  100.44,10.3 270 top
R62  98.67,25.54 270 top
R63  133.02,45.73 0 bottom
R64  133.72,40.65 0 bottom
R65  140.32,38.36 0 bottom
R66  140.77,26.23 90 bottom
R67  112,47.13 90 bottom
R68  119.75,38.11 0 bottom
R69  124.58,20.07 0 bottom
RECHT  159.75,12.33 0 top
S1  110.61,48.4 270 top
S2  110.61,34.43 270 top
S3  110.61,21.73 270 top
S4  110.61,9.03 270 top
START/NEUTRAL  160.07,42.87 0 top
SW-GR  160.13,51.19 180 top
T  5.71,29.21 0 bottom
T1  33.66,17.78 90 bottom
T2  26.04,47.62 90 bottom
T3  32.07,40.01 180 bottom
T4  45.09,4.76 0 bottom
T5  66.99,25.72 90 bottom
T6  11.43,28.57 0 bottom
T7  87.95,31.75 270 bottom
T8  82.55,29.21 270 bottom
T9  87.95,24.77 270 bottom
T10  82.23,22.23 270 bottom
T11  87.95,18.1 270 bottom
T12  82.55,15.24 270 bottom
T13  73.03,4.13 90 bottom
T14  84.14,4.13 90 bottom
T15  108.64,12.14 0 bottom
T16  126.42,4.52 0 top
T17  114.35,21.09 0 bottom
TACHSIG_REL_BLK  137.66,3.56 180 top
TANKGEB_SW1-4  145.28,27.31 180 top
TEMP...SW3  131.81,38.11 0 top
TP1  74.93,8.26 0 bottom
TP2  83.82,8.89 0 bottom
TP3  77.79,13.34 0 bottom
TP4  80.33,18.73 0 bottom
TP5  77.79,24.13 0 bottom
TP6  80.33,25.72 0 bottom
TP7  77.47,31.43 0 bottom
TP8  80.33,32.7 0 bottom
TP9  74.93,36.51 0 bottom
TP10  80.33,39.05 0 bottom
TP11  74.61,43.5 0 bottom
TP12  69.53,8.26 0 bottom
TP13  142.35,46.74 180 bottom
TP14  151.25,46.11 180 bottom
TP15  145.21,41.66 180 bottom
TP16  69.53,11.75 0 bottom
TP17  69.53,15.24 0 bottom
TP18  75.25,18.73 0 bottom
TP19  64.14,21.27 0 bottom
TP20  147.75,36.27 180 bottom
TP21  74.93,25.72 0 bottom
TP22  69.53,29.21 0 bottom
TP23  69.53,33.34 0 bottom
TP24  64.45,35.24 0 bottom
TP25  74.87,39.18 0 bottom
TP26  75.18,33.78 0 bottom
TP27  145.21,30.87 180 bottom
TP28  147.75,29.28 180 bottom
TP29  144.9,23.57 180 bottom
TP30  147.75,22.3 180 bottom
TP31  142.35,18.49 180 bottom
TP32  147.75,15.95 180 bottom
TP33  142.04,11.5 180 bottom
TP34  136.96,46.74 180 bottom
TP35  136.96,43.25 180 bottom
TP36  136.96,39.76 180 bottom
TP37  142.67,36.27 180 bottom
TP38  131.56,33.73 180 bottom
TP39  142.35,29.28 180 bottom
TP40  136.96,25.79 180 bottom
TP41  136.96,21.66 180 bottom
TP42  131.88,19.76 180 bottom
TP43  142.29,15.82 180 bottom
TP44  142.61,21.22 180 bottom
VI-SW  122.99,52.46 180 top
VI-WS  102.35,44.2 90 top
WARNLAMPE_SW4  135.62,33.66 0 top
WS  102.67,13.09 90 top
WS-BL  103.62,6.74 90 top
WS_  98.22,34.05 90 top
X1  28.64,27.5 270 top
X2  88.27,10.16 90 top
X3  78.42,51.44 180 top
X4  7.94,43.81 90 top
ZÜNDPLUS  43.18,5.84 0 bottom
ZüNDSPULE  43.18,37.85 0 bottom
ZüNDUNGSPLUS  140.07,51.06 0 top
öLDRUCK_SW2  132.13,43.06 0 top

### Tracks (layer width: path | path; a pad name or v marks a point on that pad's centre or on a via)
+12V  (via drill 0.6)  (2 unrouted)
  Top 0.406: v87,51.44 X3.1
  Top 0.457: 42.23,39.37 v35.88,39.37
  Top 0.61: 2.1 64.78,10.15 v60.01,10.16 | IC1.IN 62.23,36.83 60.01,39.37 42.23,39.37
  Bottom 0.406: R23.2 2.54,35.56 | 34.38,45.31 R37.2 | R29.2 2.86,46.99 2.86,40.96 | 2.54,39.37 R28.2 | IC3.16 87,48.9 v87,51.44
  Bottom 0.61: T14.3 80.96,9.21 79.69,10.16 74.61,10.16 73.98,9.53 71.44,6.67 T13.3 68.89,6.12 2.1 TP12.TP | T3.3 34.38,45.31 | R14.2 26.67,34.61 | v60.01,10.16 60.01,20 61.91,22.54 61.91,24.45 63.82,25.4 63.82,27.62 IC1.IN | 2.86,40.96 2.54,39.37 | R37.2 44.45,47.31 47.94,43.81 52.39,43.81 58.42,47.31 63.82,47.31 65.41,48.9 83.5,48.9 X3.1 | v35.88,39.37 35.24,39.37
  Bottom 0.813: T3.3 34.38,40.87 35.24,39.37 35.24,33.66 32.7,33.66 31.43,34.61 26.67,34.61 25.72,33.66 21.27,29.53 18.79,29.53 X1.6
  Bottom 1.016: R28.2 2.54,35.56 2.54,28.88 3.17,28.25 T.3
  Bottom 1.27: R28.2 X4.1 9.53,38.73 12.7,36.2 12.7,32.38 13.65,31.11 15.89,29.84 X1.6
GND  (via drill 0.6)  (5 unrouted)
  Top 0.61: X2.2 90.49,11.75 92.08,11.75 | v21.27,27.62 21.27,28.26 22.54,31.11 v22.54,32.7 | 116,1.66 115.05,1.66 112.83,4.2 112.83,10.87 113.78,12.14 114.42,12.77 116.32,16.58 116.32,19.44 114.42,21.34 114.42,25.47 114.73,25.16 120.45,25.16 | 101.72,39.12 104.25,39.12 104.57,38.81 104.57,37.85 106.8,35.63 106.8,32.46 106.16,31.82
  Top 0.813: v58.1,45.4 v57.59,48.32 v59.37,46.04 v58.1,45.4
  Top 1.27: v59.37,46.04 59.05,46.04 58.42,46.67
  Bottom 0.61: 33.02,27.62 34.92,29.53
  Bottom 1.27: 34.92,29.53 42.86,29.53
  pour Bottom: 0,55.24 95.89,55.24 95.89,0 0,0
  pour Bottom: 96,-0.24 163.31,-0.24 163.31,55 96,55
N$1  (via drill 0.6)  (1 unrouted)
  Top 0.813: 2.9 66.77,33.56 69.85,30.48 69.85,27.62 69.22,26.99 69.22,24.45 69.85,23.81 v71.12,22.23 | v6.35,5.4 7.08,5.88 arc-34 7.57,6.03 10.79,6.03 12.95,5.76 arc-38 13.61,5.44 15.35,3.7 arc45 15.85,3.49 48.26,3.49 56.83,7.94 v63.5,7.94
  Bottom 0.813: v71.12,22.23 68.26,19.37 66.04,19.37 63.5,16.83 v63.5,7.94 | D4.A D5.A D6.A 6.35,7.47 v6.35,5.4
  Bottom 1.016: D7.A 58.42,33.63 60.64,35.24 64.77,35.24 65.9,35.42 65.94,35.42 2.9
N$2  (via drill 0.6)
  Top 0.406: 33.97,51.12 56.52,51.12 63.18,46.04 69.22,46.04
  Top 0.61: X1.4 17.85,37.47 20.32,37.47 33.97,51.12 | 69.22,46.04 76.52,40.96 78.74,40.96 v80.96,41.91 81.03,41.85 84.58,41.85 85.72,42.99 85.72,48.26 84.77,49.21 81.6,49.21 80.96,49.85 X3.2
  Bottom 0.406: v80.96,41.91 84.45,41.91 85.72,41.27 IC3.10
  Bottom 0.61: R31.1 X4.2 10.16,41.27 13.97,38.1 17.09,38.1 X1.4
N$3  (via drill 0.6)
  Top 0.406: 32.07,52.39 56.2,52.39 63.18,47.31 68.9,47.31 | 70.48,48.26 73.98,48.26 75.25,47.62 76.2,45.09 79.38,45.09 80.87,44.71 | v83.82,44.77 83.5,44.45 81.92,44.45 80.87,44.71 | 78.74,48.9 80.33,47.31 80.33,45.25 80.87,44.71
  Top 0.61: X1.3 18.02,41.59 21.27,41.59 32.07,52.39 | 68.9,47.31 70.48,48.26 | X3.3 78.42,49.21 78.74,48.9
  Bottom 0.406: IC3.13 84.77,45.09 84.14,44.77 v83.82,44.77
  Bottom 0.61: R30.1 X4.3 10.79,43.81 13.65,41.59 17.55,41.59 X1.3
N$4
  Top 0.406: 35.88,23.5 41.91,23.5
  Top 0.61: X1.8 33.94,21.56 35.88,23.5 | 41.91,23.5 46.04,21.97 61.28,21.97 66.67,27.94 66.67,29.16 2.7
  Bottom 0.61: TP22.TP 66.81,29.21 2.7
N$5  (via drill 0.6)
  Top 0.406: v12.38,25.4 12.38,29.84 13.97,31.43 20.95,31.43 21.27,31.75 21.27,35.56 33.02,47.31 44.13,47.31 47.94,43.81 63.5,43.81 64.77,45.09 68.26,45.09 76.83,39.05 v82.55,36.2
  Bottom 0.406: T6.B 12.23,27.62 v12.38,25.4 | v82.55,36.2 R25.1
N$6  (via drill 0.6)
  Top 0.61: v87,38.1 87.31,40.96 87.31,46.67 v88.42,50.37
  Bottom 0.406: IC3.3 91.12,46.35 89.53,48.9 89.22,49.73
  Bottom 0.61: R26.2 86.67,34.92 R25.2 v87,38.1 | v88.42,50.37 89.22,49.73
N$7
  Bottom 0.406: R24.1 10.79,31.58 T6.C
N$8
  Bottom 1.27: R27.2 R28.1
N$9
  Bottom 0.406: R23.1 8.26,35.56 | 8.26,35.56 9.21,35.56 R24.2 | T.1 8.03,29.62 8.26,30.48 8.26,35.56
N$10
  Bottom 0.406: T7.B 91.58,32.7 R26.1
N$11  (via drill 0.6)
  Top 1.016: v10.16,22.23 10.16,30.48 12.7,33.02 17.36,33.02 X1.5
  Bottom 1.016: D9.K 10.3,22.08 v10.16,22.23 8.26,22.23 5.71,24.77 T.2 5.71,31.75
N$12  (1 unrouted)
  Top 0.711: 26.67,7.7 47.62,7.7
  Top 0.813: X1.12 21.59,5.71 26.67,7.7 | 47.62,7.7 58.1,11.75 2.2
  Bottom 0.61: 17.46,5.71 18.41,5.71 | TP16.TP 2.2
  Bottom 0.813: D6.K 11.75,7.62 17.46,5.71
N$13
  Top 0.711: 46.3,11.67 30.11,11.67
  Top 0.813: 2.3 66.75,15.24 58.1,15.24 46.3,11.67 | 30.11,11.67 21.43,9.68 X1.11
  Bottom 0.61: TP17.TP 2.3
  Bottom 0.813: D5.K 13,10.63 X1.11
N$14
  Top 0.711: 36.51,15.61 43.81,15.61
  Top 0.813: X1.10 17.8,13.65 35.24,13.65 36.51,15.61 | 43.81,15.61 57.15,17.46 68.9,17.46 70.19,18.75 2.4
  Bottom 0.61: TP18.TP 72.28,18.73 2.4
  Bottom 0.813: D4.K 13.02,13.97 14.91,13.64 X1.10
N$15  (via drill 0.6)
  Top 0.406: 17.91,25.4 X1.7 | v46.67,26.04 R18.1
  Top 0.813: v32.07,31.43 29.53,32.38 27.3,32.38 24.77,30.8 23.5,28.89 23.18,26.99 21.91,25.4 17.91,25.4
  Bottom 0.406: R5.2 v46.67,26.04
  Bottom 0.457: 44.45,31.43 v32.07,31.43
  Bottom 0.61: IC4.1 44.45,31.75 44.45,31.43 R18.1
N$16
  Bottom 0.406: IC5.5 52.07,20.32 48.9,20.32 47.94,22.54 R5.1 41.91,23.5 36.83,23.5 31.43,21.59 26.67,18.73 IC2.6
N$17  (via drill 0.6)
  Top 0.406: 29.21,53.66 56.2,53.66 62.87,48.58 67.94,48.58 | v79.06,46.67 75.56,49.21 68.9,49.21
  Top 0.61: X1.2 17.87,45.4 20.95,45.4 29.21,53.66 | 67.94,48.58 68.9,49.21 | X3.4 75.56,51.44 75.56,49.21
  Bottom 0.406: IC3.12 84.77,43.81 84.14,43.5 82.55,43.5 79.69,45.09 v79.06,46.67
  Bottom 0.61: R29.1 X4.4 10.79,46.35 13.97,45.4 17.7,45.4 X1.2
N$18
  Bottom 0.406: R32.1 85.09,29.52 T8.B
N$19
  Top 0.61: 64.14,42.55 65.09,41.27 66.36,41.27 66.99,40.64 66.99,39.37 69.53,37.15 69.53,33.02 | 72.53,33.02 2.8
  Top 0.813: X1.14 43.58,45.32 46.35,42.55 64.14,42.55 | 69.53,33.02 72.53,33.02
  Bottom 1.016: 2.8 TP23.TP 69.39,33.19 69.05,33.19 64.45,33.02 D7.K
N$20  (via drill 0.81)
  Top 0.813: X1.17 42.33,33.44 46.99,36.83 v58.42,36.83
  Bottom 0.61: 58.42,39.23 D1.A
  Bottom 0.813: v58.42,36.83 58.42,39.23
  Bottom 1.016: 1.9 75.19,36.25 TP9.TP 70.94,36.69 69.22,38.1 64.77,38.1 63.5,36.83 v58.42,36.83
N$21  (via drill 0.6)
  Top 0.61: X1.19 41.71,25.52 42.86,27.94 42.86,28.89 43.81,30.16 45.76,30.16 48.09,27.62 51.12,27.62 52.07,26.67 54.93,26.67 56.2,27.94 v56.2,35.24
  Bottom 0.61: D2.A 56.2,42.55 v56.2,35.24
  Bottom 1.016: D2.A 58.12,43.52 60.64,45.09 68.9,45.09 70.17,43.5 TP11.TP 74.93,43.18 76.8,43.18 1.11
N$22
  Bottom 1.016: 1.10 TP10.TP 77.98,39.12 76.59,40.51 74.61,41.59 69.85,41.59 69.53,41.27 63.16,41.27
  Bottom 1.422: D1.K 63.16,41.27 D2.K
N$23
  Bottom 0.406: R1.2 33.66,5.71 35.56,7.62 35.56,10.79 | 37.78,13.02 38.86,13.02 X1.22
  Bottom 0.61: 35.56,10.79 37.78,13.02
N$24  (1 unrouted)
  Bottom 0.406: IC2.3 26.8,5.66 C1.1 28.57,5.71 | 28.57,5.71 28.89,5.71 | 28.89,5.71 28.26,5.4 28.57,5.71 | 28.89,5.71 R1.1
N$25
  Bottom 0.406: IC2.2 27.62,11.75 27.31,12.06 R2.2
N$26  (via drill 0.6)
  Top 0.61: 2.11 69.78,38.8 73.03,35.56 | 73.03,35.56 74.93,33.66 74.93,24.77 73.66,23.5 73.66,21.91 72.39,20.64 69.53,20.64 68.58,19.43 48.26,19.43 42.86,17.46 39.62,17.46 X1.21 | v72.39,34.92 73.03,35.56
  Bottom 0.406: T1.C 37.4,17.78 X1.21
  Bottom 0.61: TP26.TP 73.34,34.92 v72.39,34.92
N$27
  Bottom 0.406: IC2.1 29.79,10.1 30.16,9.53 R3.2
N$28
  Bottom 0.406: R4.1 33.97,14.6 | 33.97,14.6 R3.1 | T1.B 32.55,15.39 32.7,15.24 33.97,14.6
N$29
  Bottom 0.61: R18.2 51.75,28.57 50.16,29.53 IC4.2
N$30
  Bottom 0.406: R7.1 53.34,22.55 | 53.34,22.55 R8.2 | IC5.6 53.34,22.55
N$31  (via drill 0.6)
  Top 0.406: v56.52,23.36 56.52,26.35 58.1,27.94 58.1,33.97 60.01,36.2 60.01,37.47 59.37,38.1 46.35,38.1 41.91,35.4 | 36.2,35.4 34.61,36.51 27.62,36.51 v22.54,34.29
  Top 0.457: 41.91,35.4 36.2,35.4
  Bottom 0.406: IC5.7 54.61,20 55.24,20.64 55.88,20.64 56.52,21.27 v56.52,23.36 | v22.54,34.29 23.5,34.92 R9.2
N$32
  Bottom 0.406: R13.2 26.67,44.45 27.3,45.09 27.3,47.45
  Bottom 0.61: 27.3,47.45 T2.C
N$33
  Bottom 0.61: 88.14,8.89 88.9,8.89 89.66,8.13
N$34
  Bottom 0.406: T2.B 25.08,46.67 25.08,39.37 23.5,39.37 | 23.5,39.37 R11.1 | R9.1 23.5,39.37
N$35  (via drill 0.6)
  Top 0.457: 42.55,31.43 36.51,31.43
  Top 0.61: IC4.3 52.83,33.97 52.26,34.29 46.61,34.29 42.55,31.43 | 34.61,33.34 36.51,31.43
  Top 0.813: v33.34,34.92 34.61,33.34
  Bottom 0.406: 32.07,45.4 R37.1
  Bottom 0.61: 32.07,36.83 T3.2 32.07,45.4
  Bottom 0.813: 32.07,36.83 33.34,36.83 v33.34,34.92
N$36
  Bottom 0.406: 29.76,39.6 29.53,39.37 26.67,39.37 R13.1 R14.1
  Bottom 0.61: T3.1 29.76,39.6
N$37  (via drill 0.6)
  Top 0.61: v90.49,14.29 88.9,14.29 87.31,15.56 87.31,33.66 v88.9,38.73
  Bottom 0.406: v88.9,38.73 88.9,45.72 88.27,46.35 IC3.14
  Bottom 0.61: R36.2 v90.49,14.29
N$38  (via drill 0.6)
  Top 0.61: v90.81,49.53 90.81,39.37 91.44,38.1 91.44,36.2 89.85,31.43 89.85,24.45 91.44,23.18 92.71,23.18 93.34,22.23 v93.34,20.64
  Bottom 0.406: IC3.2 91.76,47.62 v90.81,49.53
  Bottom 0.61: v93.34,20.64 R35.2
N$39
  Bottom 0.406: T10.C 80.16,22.25 1.5
  Bottom 0.61: 1.5 77.56,23.9 TP5.TP
N$40  (via drill 0.6)
  Top 0.406: v52.7,24.45 44.45,24.45 v43.5,25.4
  Bottom 0.406: R6.1 58.42,24.68 55.25,24.68 R7.2 v52.7,24.45 | IC2.5 25.4,19.37 28.26,20.95 33.97,23.81 36.51,27.46 42.23,27.46 43.5,25.88 v43.5,25.4
N$41  (via drill 0.6)
  Top 0.406: v34.61,15.72 30.8,17.78 v27.94,17.78
  Bottom 0.406: R10.2 42.23,15.72 v34.61,15.72 | v27.94,17.78 IC2.7
N$42
  Top 0.61: X1.16 42.23,37.4 ZüNDSPULE.TP
N$43
  Bottom 0.406: IC5.1 55.88,10.48 | 55.88,10.48 R21.2 | R19.2 55.88,5.08 55.88,10.48
N$44
  Bottom 0.406: T4.B R20.1 51.12,4.13 R19.1
N$45
  Bottom 0.406: R12.2 46.99,17.14 R10.1 45.72,13.65 45.4,12.7 C2.1
N$46
  Bottom 0.406: IC5.3 53.34,15.24 R12.1 48.9,12.38 48.58,12.06 C3.1
N$47  (1 unrouted)
  Bottom 0.406: R15.1 58.42,15.24 54.61,15.24 IC5.2 54.61,11.43 53.98,9.84 R17.2
N$48
  Bottom 0.406: R22.1 R21.1 61.28,8.57 61.28,19.52 63.18,22.54 64.77,24.77 T5.B
N$49
  Bottom 0.406: T4.C 45.87,5.86 46.67,6.67 52.22,6.82 R17.1
N$50
  Bottom 0.406: T9.C 84.28,25.75 1.6
  Bottom 0.61: TP6.TP 83.03,25.72 1.6
N$51
  Bottom 0.406: R34.1 85.09,22.54 T10.B
N$52
  Bottom 0.406: 1.8 83.11,32.7 85.09,32.7 85.58,32.55 T7.C
  Bottom 0.61: TP8.TP 83.01,32.7 1.8
N$53  (via drill 0.6)
  Top 0.813: X1.15 43.18,40.96 61.51,40.96 64.77,39.69 v65.41,39.69
  Bottom 0.61: TP25.TP 72.2,39.69
  Bottom 0.813: v65.41,39.69 72.2,39.69 2.10
N$54
  Bottom 1.016: D3.A 3.49,16.83
  Bottom 1.27: 3.49,16.83 2.54,13.97 R27.1
N$55
  Top 0.406: 42.07,19.53 36.04,19.53 35.88,19.37
  Top 0.61: 2.5 64.14,22.25 61.91,20.7 46.38,20.73 42.07,19.53 | X1.9 17.92,17.46 21.59,17.46 26.35,19.37 35.88,19.37
  Bottom 0.61: TP19.TP 64.14,21.36 65.02,22.25 2.5
  Bottom 0.813: D3.K 17.79,17.14 X1.9
N$56
  Bottom 0.406: R33.1 89.54,25.71 T9.B
N$57
  Bottom 0.406: R35.1 90.81,17.14 90.49,19.05 T11.B
N$58
  Top 0.61: X1.24 43.06,5.72 ZÜNDPLUS.TP
N$59
  Bottom 0.61: T14.2 83.82,4.13 | 83.82,4.13 86.68,4.13 | 1.2 83.69,11.55 83.69,10.92 TP2.TP 83.82,4.13
N$60
  Bottom 0.406: 2.6 68.76,25.75 T5.C
  Bottom 0.61: TP21.TP 72.3,25.72 2.6
N$61  (via drill 0.6)
  Bottom 0.406: 93.34,31.11 93.66,31.75 93.66,36.2 91.44,38.42 91.44,42.55 IC3.6
  Bottom 0.61: R32.2 v92.71,30.48 93.34,31.11
N$62
  Bottom 0.406: R36.1 84.78,15.87 T12.B
N$63
  Bottom 0.406: T8.C 80.78,29.25 1.7
  Bottom 0.61: TP7.TP 77.47,29.34 1.7
N$64  (via drill 0.6)
  Top 0.61: v92.39,27.94 91.12,28.89 91.12,31.11 92.71,35.24 v92.71,50.8
  Bottom 0.61: R33.2 v92.39,27.94 | v92.71,50.8 92.71,48.9 IC3.1
N$65  (via drill 0.6)
  Top 0.61: v91.44,21.59 90.17,21.59 88.58,23.18 88.58,32.38 v90.17,37.47
  Bottom 0.406: v90.17,37.47 90.17,45.72 88.9,47.62 IC3.15
  Bottom 0.61: R34.2 v91.44,21.59
N$66
  Bottom 0.406: T11.C 84.92,18.75 1.4
  Bottom 0.61: TP4.TP 83.04,18.73 1.4
N$67
  Bottom 0.406: T12.C 80.17,15.25 1.3
  Bottom 0.61: TP3.TP 77.79,15.02 1.3
N$68  (1 unrouted)
  Top 0.61: X2.1 92.08,8.89 R39.2
  Bottom 0.61: T13.1 70.26,1.5 | R39.2 92.08,8.89 91.44,8.26 89.53,8.26 89.53,1.33 80.64,1.27 80.42,1.5 T14.1 80.49,1.27 76.2,1.27 | 76.2,4.13 T13.2 T13.1 | 76.2,1.27 70.16,1.27 T13.1 | 76.2,1.27 76.2,3.17
N$69  (via drill 0.6)
  Top 1.016: X1.1 13.97,49.21 11.75,47.62 11.75,35.56 7.3,31.11 7.3,11.51 arc-45 6.13,8.67 5.1,7.64 arc45 4.45,6.05 4.45,5.03 arc90 6.3,3.17 v8.26,3.17 | v14.92,1.91 50.48,1.91 59.05,6.03 72.16,6.03 1.1
  Bottom 0.61: v8.26,3.17 10.79,4.76 12.38,4.76 13.65,3.81 v14.92,1.91 | TP1.TP 1.1
N$70
  Bottom 0.61: 35.05,47.24 35.05,45.97 34.54,45.47
N$75
  Bottom 0.61: TP42.TP 132.95,19.76 R58.1
N$83
  Top 0.61: ABS_BLINK.K 139.37,12.96 140.45,14.04 140.45,22.3 TP40.TP
N$84
  Bottom 0.61: R64.1 136.07,40.65 TP36.TP
N$85
  Bottom 0.61: R65.1 141.85,37.09 TP37.TP
N$86  (via drill 0.61)
  Top 0.61: TP41.TP 136.96,22.93 135.37,24.52 133.78,24.52 v130.61,26.11
  Bottom 0.61: v130.61,26.11 130.61,30.11 R57.1
N$87
  Bottom 0.61: RECHT.A 159.12,13.47 157.59,14.99 152.51,14.99 147.44,18.17 142.67,18.17 TP31.TP
N$88
  Bottom 0.61: LINKS.A 143.12,12.58 TP33.TP
N$89
  Bottom 0.61: BEIDE.A 153.15,12.46 151.25,14.36 149.34,14.36 TP32.TP
N$90
  Bottom 0.61: GESCHW_WAGO_BLK.K 144.51,5.85 139.81,10.55 139.81,11.82 140.45,12.46 140.45,20.07 141.72,21.34 142.48,21.34 TP44.TP
N$91  (1 unrouted)
  Top 0.61: TP30.TP 147.75,24.2 149.66,25.79 149.66,32.14 145.53,35.31 145.53,37.22 146.48,38.17 153.47,42.94
N$92
  Bottom 0.61: GANG_5.K 156.58,19.19 153.78,21.98 151.25,21.98 148.71,24.52 145.85,24.52 TP29.TP
N$93
  Bottom 0.406: 160.52,38.11 159.5,38.49 158.23,38.81 156.96,40.4
  Bottom 0.61: GANG_5.A GANG_4.A GANG_3.A GANG_2.A GANG_1.A 160.52,38.11 | 156.96,40.4 156.96,41.66 NEUTRAL.A 156.07,43.19 154.42,44.84 152.51,44.84 TP14.TP
N$94
  Bottom 0.61: TP13.TP 143.94,46.74 146.48,49.28 146.48,50.62 DAUERPLUS.A
N$95
  Bottom 0.61: GANG_3.K 157.98,29.22 156.96,30.23 154.42,30.23 153.47,31.19 146.16,31.19 145.85,30.87 TP27.TP
N$96
  Bottom 0.61: GANG_4.K 157.98,24.77 156.96,25.79 151.25,25.79 TP28.TP
N$97
  Bottom 0.61: R66.2 140.89,29.09 TP39.TP
N$98
  Bottom 0.61: GANG_2.K arc90 155.56,35.31 148.71,35.31 TP20.TP
N$99
  Bottom 0.61: GANG_1.K 156.32,38.49 147.44,38.49 145.21,40.71 TP15.TP
N$100
  Bottom 0.813: IC6.3 118.73,12.58 GB-WS.TP
N$101
  Bottom 0.406: 113.78,2.93 117.91,2.93
  Bottom 0.61: R47.2 112.64,4.39 113.78,2.93 | 117.91,2.93 118.54,2.61 120.13,2.61 122.67,5.15 122.67,8.64 121.4,9.91 120.51,9.91 IC6.2
  Bottom 0.813: 117.47,8.84 GB-SW.TP 117.91,8.96 118.86,9.91 120.26,9.91 IC6.2
N$102
  Bottom 0.61: LADEKONTROL_BLK.K 138.8,34.11 137.91,35.31 132.83,35.31 TP38.TP
N$103
  Bottom 0.406: R40.2 158.11,45.03 START/NEUTRAL.A
N$104
  Bottom 0.406: R40.1 158.55,48.52 158.55,50.24
  Bottom 0.61: 158.55,50.24 SW-GR.TP
N$105  (1 unrouted)
  Bottom 0.406: 109.33,19.12 111.88,20.71 112.66,21.98 | R54.2 106.6,17.09 R53.2
  Bottom 0.61: 116.64,23.25 118.86,27.7 118.86,37.22 116.64,39.12 116.64,41.59 | R54.2 109.14,19.12 R56.1 | 108.89,17.72 109.33,19.12 | 112.66,21.98 T17.C
  Bottom 0.813: T17.C 115.26,22.19 116.64,23.25 | 116.64,41.59 IC8.1
N$106
  Bottom 0.61: RECHT.K 160.71,10.23 R41.1
N$107
  Bottom 0.61: BEIDE.K 155.94,9.72 R42.1
N$108
  Bottom 0.61: LINKS.K 149.59,10.1 R43.1
N$109
  Bottom 0.61: DAUERPLUS.K 150.17,51 150.61,50.87 151.62,50.87 R44.1
N$110
  Bottom 0.61: ZüNDUNGSPLUS.K 143.69,51.06 R45.1
N$111
  Top 0.61: FERNLICHT_BLK.K 144.96,8.39 145.21,8.64 145.21,11.19 142.99,14.36 142.99,15.12 TP43.TP
N$112
  Bottom 0.406: 112.19,8.01 112.19,9.91 110.92,10.87 109.42,10.87 T15.B
  Bottom 0.61: R47.1 111.56,7.69 112.19,8.01
N$113
  Top 0.406: T16.B 125.47,3.18 R48.1
N$114
  Bottom 0.813: T15.E 104.42,10.72 BL-SW.TP
N$115
  Top 0.406: 127.11,1.66 127.43,1.98 127.43,3.03 T16.E
  Top 0.61: BL-RT.TP 127.11,1.66
N$116  (1 unrouted)
  Bottom 0.406: 116,11.5 116,13.09 114.73,14.99 | T17.B 115.3,19.82 116.32,18.8 116.32,16.27 115.69,15.63 115.11,15.63 R55.2
  Bottom 0.813: R49.1 115.56,10.74 116,11.5
N$117
  Bottom 0.813: R51.2 R50.2 101.53,1.72 C5.1
N$118
  Bottom 0.813: C5.2 98.16,2.87 GR.TP
N$119
  Bottom 0.61: TACHSIG_REL_BLK.K 136.39,3.63 R52.1
N$120
  Bottom 0.61: R52.2 133.02,3.05 BL-GR.TP
N$121  (1 unrouted)
  Top 0.406: R48.2 121.59,4.9 120.38,6.11 IC6.1
  Bottom 0.61: 119.5,4.71 117.4,4.71 R49.2
  Bottom 0.813: IC6.1 120.38,5.72 GE-BL.TP | 119.5,4.71 R51.1
N$122
  Bottom 0.61: 103.87,13.09 R53.1
  Bottom 0.813: WS.TP 103.87,13.09
N$123
  Bottom 0.813: BL.TP 102.98,16.45 R54.1
N$124
  Bottom 0.508: 129.97,18.8 129.97,21.54
  Bottom 0.61: LADEKONTROL_BLK.A 131.56,17.54 129.97,18.8 | 129.97,21.54 R46.1
N$125
  Bottom 0.813: VI-SW.TP 123.31,45.43 IC8.2 126.61,48.73
N$126
  Bottom 0.61: R58.2 134.35,27.95 136.96,30.55 136.96,33.6 WARNLAMPE_SW4.K
N$127
  Bottom 0.61: LAMPENTEST_SW4.K 128.64,30.3 R57.2
N$128
  Bottom 0.61: GESCHW_WAGO_BLK.A 141.97,5.28 R59.1
N$129
  Bottom 0.61: R62.2 98.67,20.52 100.13,21.34 100.13,35 101.08,35.95 103.94,35.95
  Bottom 0.813: BR-GR.TP 100.38,16.58 R61.1 100.44,17.66 R60.1 101.72,19.19 R62.2 | S2.3 105.46,34.43 103.94,35.95
N$130
  Bottom 0.813: R61.2 100.83,3.95 WS-BL.TP 108.32,6.74 S4.3
N$131
  Bottom 0.813: BR-SW.TP 101.84,33.92 R60.2 102.03,30.68 102.03,25.16 105.84,21.66 110.35,21.73 S3.3
N$132
  Bottom 0.61: TP35.TP 136.76,43.25 R63.1
N$133
  Bottom 0.61: öLDRUCK_SW2.K 133.08,40.96 R64.2
N$134
  Bottom 0.61: R63.2 132.19,46.36 132.51,47.44 CHOKE_SW1.K
N$135
  Bottom 0.61: R65.2 138.86,37.85 138.54,37.73 134.74,37.73 TEMP...SW3.K
N$137
  Bottom 0.61: TANKGEB_SW1-4.K 143.88,27.31 142.99,25.47 141.21,25.47 R66.1
N$138
  Top 0.61: IC7.2 122.54,33.92 118.86,31.5 118.92,31.5 IC7.6
  Bottom 0.61: IC7.6 115.69,32.14 113.46,32.14 112.83,31.82 109.14,31.7 C6.1 | IC7.2 123.11,33.92 122.03,35 122.03,37.54 122.67,38.17 124.13,38.17 R68.1
N$139
  Bottom 0.406: IC7.7 114.35,34.11 112.19,37.22 112.19,37.85 R68.2
  Bottom 0.813: R67.1 112,39.25 R68.2
N$140
  Bottom 0.61: C7.1 112.32,28.71 IC7.5
N$141
  Bottom 0.406: 126.48,28.01 126.48,29.92
  Bottom 0.61: 125.53,27.06 126.48,28.01 | 126.48,29.92 125.53,31.19
  Bottom 0.813: IC6.10 126.67,22.74 125.53,23.89 125.53,27.06 | 125.53,31.19 124.32,31.19 IC7.3
N$142
  Bottom 0.61: TP34.TP 136.96,49.22 ZüNDUNGSPLUS.A
N$143
  Bottom 0.61: IC6.11 125.65,20.2 R69.1
N$144  (via drill 0.61)
  Bottom 0.61: 125.53,20.39 v125.53,17.85
VCC  (via drill 0.61)  (5 unrouted)
  Top 0.406: T16.C 126.63,5.3 128.07,6.74 128.07,7.44 IC6.16
  Top 0.508: 119.81,35.16 126.48,35.16
  Top 0.61: 105.84,46.11 109.33,42.62 109.33,37.85 110.73,36.46 IC7.8 117.14,36.46 119.81,35.16 | 105.84,46.11 104.89,47.06 12V_.TP 12V.TP GR-SW.TP | R67.2 112,52.27 105.84,46.11 | 126.48,35.16 127.75,35 128.77,36.59 129.66,38.11 TEMP...SW3.A | IC7.4 124.13,27.25 116,27.06 113.46,27.06 112.51,26.11 112.51,19.44 v110.61,14.36 | v124.26,14.99 124.26,28.65 124,28.65 IC7.4 | IC7.4 125.4,28.84 126.48,29.92 126.48,31.82 126.16,32.14 126.16,33.35 LAMPENTEST_SW4.A
  Bottom 0.406: R15.2 58.42,19.68 | 58.42,19.68 R6.2 59.37,21.59 60.33,22.86 60.33,23.18 60.33,25.4 IC1.OUT | 58.42,19.68 57.78,19.68 56.58,18.48 IC5.8 55.88,16.83 55.56,16.51 51.44,16.51 50.8,16.83 50.8,18.41 50.16,19.05 42.86,19.05 41.91,19.53 35.24,19.53 33.97,20.64 31.43,20.64 29.21,17.46 IC2.8 | 61.28,26.03 59.06,26.03 58.42,26.67 C4.1 | T15.C 108.64,14.36 108.64,15.19 R56.2 | TANKGEB_SW1-4.A 144.26,29.28 143.62,30.23 143.31,31.19 143.31,32.46
  Bottom 0.508: 129.66,35.63 129.66,32.46
  Bottom 0.61: IC1.OUT 61.28,26.03 | 59.05,26.04 60.33,24.77 | 59.37,25.72 60.33,25.72 | TACHSIG_REL_BLK.A 139.37,4.01 R59.2 138.67,5.98 FERNLICHT_BLK.A | ABS_BLINK.A FERNLICHT_BLK.A | CHOKE_SW1.A 130.93,48.02 130.61,47.7 130.61,43.89 130.93,43.57 130.93,42.94 130.86,38.43 TEMP...SW3.A 130.8,36.59 130.93,36.59 | 143.31,32.46 140.13,36.59 130.93,36.59 | WARNLAMPE_SW4.A 134.35,31.82 | 134.35,31.82 134.35,30.81 132.51,28.96 132.51,26.3 R46.2 | 130.93,36.59 129.66,35.63 | 129.66,32.46 130.61,31.82 134.35,31.82 | v110.61,14.36 108.64,14.36 | IC6.16 126.67,7.5 125.53,8.64 125.53,13.09 v124.26,14.99 | IC6.16 128.09,7.5 | FERNLICHT_BLK.A 130.67,8.39 129.66,7.38 128.13,7.38 IC6.16
VI-WS
  Bottom 0.813: VI-WS.TP 107.68,44.2 S1.3
WS
  Bottom 0.813: R62.1 98.67,33.6 WS_.TP

### Text on the board
Top: top
tPlace: G5 | G4 | G3 | G2 | G1
bPlace: G2 | G4
tNames: SW1:0 / SW2:1 / SW3:1 / SW4:0 | www.flyingbrick.de
bNames: 3x | LM2904
tStop: flying / brick | www.flyingbrick.de
tDocu: +12v